# Altium schematic sheet 04. DDRAM.SchDoc
size A3
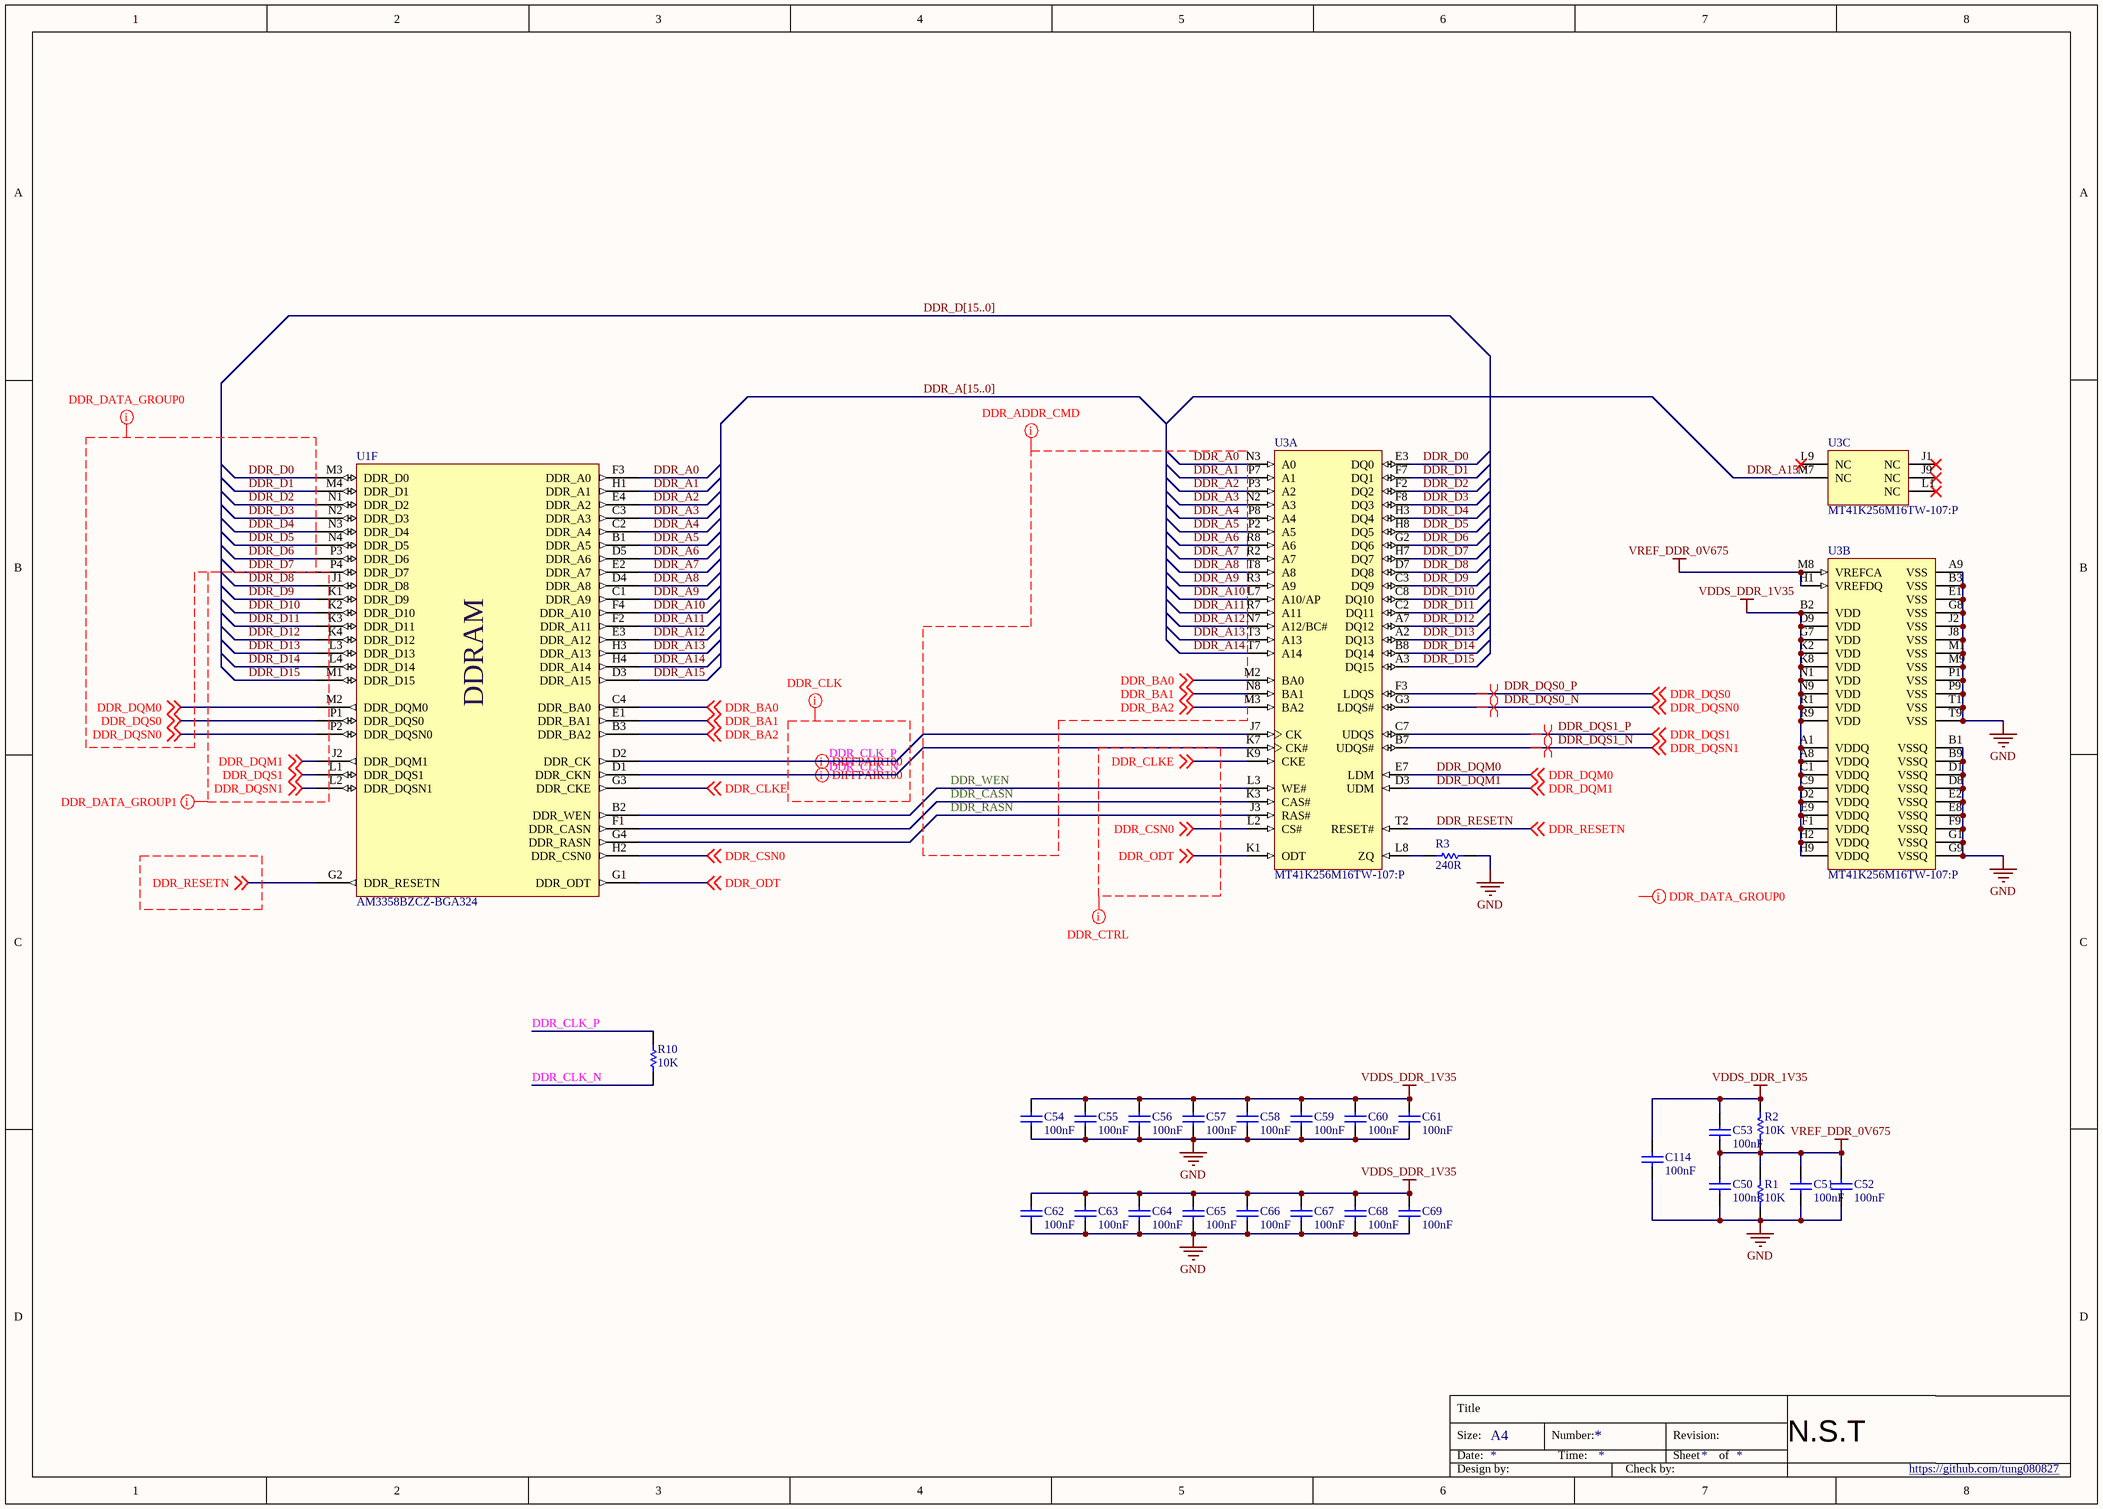
[diagram p0: 04. DDRAM.SchDoc]

## Parts
C50  100nF  [CAPC1005X60X30LL05T10]
C51  100nF  [CAPC1005X60X30LL05T10]
C52  100nF  [CAPC1005X60X30LL05T10]
C53  100nF  [CAPC1005X60X30LL05T10]
C54  100nF  [CAPC1005X60X30LL05T10]
C55  100nF  [CAPC1005X60X30LL05T10]
C56  100nF  [CAPC1005X60X30LL05T10]
C57  100nF  [CAPC1005X60X30LL05T10]
C58  100nF  [CAPC1005X60X30LL05T10]
C59  100nF  [CAPC1005X60X30LL05T10]
C60  100nF  [CAPC1005X60X30LL05T10]
C61  100nF  [CAPC1005X60X30LL05T10]
C62  100nF  [CAPC1005X60X30LL05T10]
C63  100nF  [CAPC1005X60X30LL05T10]
C64  100nF  [CAPC1005X60X30LL05T10]
C65  100nF  [CAPC1005X60X30LL05T10]
C66  100nF  [CAPC1005X60X30LL05T10]
C67  100nF  [CAPC1005X60X30LL05T10]
C68  100nF  [CAPC1005X60X30LL05T10]
C69  100nF  [CAPC1005X60X30LL05T10]
C114  100nF  [CAPC1005X60X30LL05T10]
R1  10K  [RESC1005X40X25LL05T05]
R2  10K  [RESC1005X40X25LL05T05]
R3  240R  [RESC1005X40X25LL05T05]
R10  10K  [RESC1005X40X25ML05T05]
U1  AM3358BZCZ-BGA324  [TI-ZCZ324]  (part F of 11)
U3  MT41K256M16TW-107:P  [MICT-TW-96]  (parts A,B,C of 3)

## Nets
GND: C50.1 C51.1 C52.1 C54.1 C55.1 C56.1 C57.1 C58.1 C59.1 C60.1 C61.1 C62.1 C63.1 C64.1 C65.1 C66.1 C67.1 C68.1 C69.1 C114.1 R1.1 R3.2 U3.A9(VSS) U3.B1(VSSQ) U3.B3(VSS) U3.B9(VSSQ) U3.D1(VSSQ) U3.D8(VSSQ) U3.E1(VSS) U3.E2(VSSQ) U3.E8(VSSQ) U3.F9(VSSQ) U3.G1(VSSQ) U3.G8(VSS) U3.G9(VSSQ) U3.J2(VSS) U3.J8(VSS) U3.M1(VSS) U3.M9(VSS) U3.P1(VSS) U3.P9(VSS) U3.T1(VSS) U3.T9(VSS)
VDDS_DDR_1V35: C53.2 C54.2 C55.2 C56.2 C57.2 C58.2 C59.2 C60.2 C61.2 C62.2 C63.2 C64.2 C65.2 C66.2 C67.2 C68.2 C69.2 C114.2 R2.2 U3.A1(VDDQ) U3.A8(VDDQ) U3.B2(VDD) U3.C1(VDDQ) U3.C9(VDDQ) U3.D2(VDDQ) U3.D9(VDD) U3.E9(VDDQ) U3.F1(VDDQ) U3.G7(VDD) U3.H2(VDDQ) U3.H9(VDDQ) U3.K2(VDD) U3.K8(VDD) U3.N1(VDD) U3.N9(VDD) U3.R1(VDD) U3.R9(VDD)
VREF_DDR_0V675: C50.2 C51.2 C52.2 C53.1 R1.2 R2.1 U3.H1(VREFDQ) U3.M8(VREFCA)
DDR_A0: U1.F3(DDR_A0) U3.N3(A0)
DDR_A1: U1.H1(DDR_A1) U3.P7(A1)
DDR_A2: U1.E4(DDR_A2) U3.P3(A2)
DDR_A3: U1.C3(DDR_A3) U3.N2(A3)
DDR_A4: U1.C2(DDR_A4) U3.P8(A4)
DDR_A5: U1.B1(DDR_A5) U3.P2(A5)
DDR_A6: U1.D5(DDR_A6) U3.R8(A6)
DDR_A7: U1.E2(DDR_A7) U3.R2(A7)
DDR_A8: U1.D4(DDR_A8) U3.T8(A8)
DDR_A9: U1.C1(DDR_A9) U3.R3(A9)
DDR_A10: U1.F4(DDR_A10) U3.L7(A10/AP)
DDR_A11: U1.F2(DDR_A11) U3.R7(A11)
DDR_A12: U1.E3(DDR_A12) U3.N7(A12/BC#)
DDR_A13: U1.H3(DDR_A13) U3.T3(A13)
DDR_A14: U1.H4(DDR_A14) U3.T7(A14)
DDR_A15: U1.D3(DDR_A15) U3.M7(NC)
DDR_BA0: U1.C4(DDR_BA0) U3.M2(BA0) ; off-sheet DDR_BA0
DDR_BA1: U1.E1(DDR_BA1) U3.N8(BA1) ; off-sheet DDR_BA1
DDR_BA2: U1.B3(DDR_BA2) U3.M3(BA2) ; off-sheet DDR_BA2
DDR_CASN: U1.F1(DDR_CASN) U3.K3(CAS#)
DDR_CLK_N: R10.2 U1.D1(DDR_CKN) U3.K7(CK#)
DDR_CLK_P: R10.1 U1.D2(DDR_CK) U3.J7(CK)
DDR_CLKE: U1.G3(DDR_CKE) U3.K9(CKE) ; off-sheet DDR_CLKE
DDR_CSN0: U1.H2(DDR_CSN0) U3.L2(CS#) ; off-sheet DDR_CSN0
DDR_D0: U1.M3(DDR_D0) U3.E3(DQ0)
DDR_D1: U1.M4(DDR_D1) U3.F7(DQ1)
DDR_D2: U1.N1(DDR_D2) U3.F2(DQ2)
DDR_D3: U1.N2(DDR_D3) U3.F8(DQ3)
DDR_D4: U1.N3(DDR_D4) U3.H3(DQ4)
DDR_D5: U1.N4(DDR_D5) U3.H8(DQ5)
DDR_D6: U1.P3(DDR_D6) U3.G2(DQ6)
DDR_D7: U1.P4(DDR_D7) U3.H7(DQ7)
DDR_D8: U1.J1(DDR_D8) U3.D7(DQ8)
DDR_D9: U1.K1(DDR_D9) U3.C3(DQ9)
DDR_D10: U1.K2(DDR_D10) U3.C8(DQ10)
DDR_D11: U1.K3(DDR_D11) U3.C2(DQ11)
DDR_D12: U1.K4(DDR_D12) U3.A7(DQ12)
DDR_D13: U1.L3(DDR_D13) U3.A2(DQ13)
DDR_D14: U1.L4(DDR_D14) U3.B8(DQ14)
DDR_D15: U1.M1(DDR_D15) U3.A3(DQ15)
DDR_DQM0: U1.M2(DDR_DQM0) U3.E7(LDM) ; off-sheet DDR_DQM0
DDR_DQM1: U1.J2(DDR_DQM1) U3.D3(UDM) ; off-sheet DDR_DQM1
DDR_DQS0_N: U1.P2(DDR_DQSN0) U3.G3(LDQS#) ; off-sheet DDR_DQSN0  [also labelled DDR_DQSN0]
DDR_DQS0_P: U1.P1(DDR_DQS0) U3.F3(LDQS) ; off-sheet DDR_DQS0  [also labelled DDR_DQS0]
DDR_DQS1_N: U1.L2(DDR_DQSN1) U3.B7(UDQS#) ; off-sheet DDR_DQSN1  [also labelled DDR_DQSN1]
DDR_DQS1_P: U1.L1(DDR_DQS1) U3.C7(UDQS) ; off-sheet DDR_DQS1  [also labelled DDR_DQS1]
DDR_ODT: U1.G1(DDR_ODT) U3.K1(ODT) ; off-sheet DDR_ODT
DDR_RASN: U1.G4(DDR_RASN) U3.J3(RAS#)
DDR_RESETN: U1.G2(DDR_RESETN) U3.T2(RESET#) ; off-sheet DDR_RESETN
DDR_WEN: U1.B2(DDR_WEN) U3.L3(WE#)
NetR3_1: R3.1 U3.L8(ZQ)

Not connected (* = marked no-connect by the designer): U3 J1(NC)* J9(NC)* L1(NC)* L9(NC)*

## Buses and harness runs
bus DDR_A[15..0]
bus DDR_D[15..0]

## Layout directives
net class DDR_DATA_GROUP0; rule Matched Net Lengths [Tolerance = 10mil]: DDR_D0, DDR_D1, DDR_D2, DDR_D3, DDR_D4, DDR_D5, DDR_D6, DDR_D7, DDR_DQM0, DDR_DQS0, DDR_DQSN0
net class DDR_DATA_GROUP1; rule Matched Net Lengths [Tolerance = 10mil]: DDR_D7, DDR_D8, DDR_D9, DDR_D10, DDR_D11, DDR_D12, DDR_D13, DDR_D14, DDR_D15, DDR_DQM1, DDR_DQS1, DDR_DQSN1
net class DDR_DATA_GROUP0; rule Matched Net Lengths [Tolerance = 20mil]: (no net found under the mark)
net class DDR_ADDR_CMD; rule Matched Net Lengths [Tolerance = 20mil]; Parameter 1: MATCHED LENGTH: DDR_A0, DDR_A1, DDR_A2, DDR_A3, DDR_A4, DDR_A5, DDR_A6, DDR_A7, DDR_A8, DDR_A9, DDR_A10, DDR_A11, DDR_A12, DDR_A13, DDR_A14, DDR_BA0, DDR_BA1, DDR_BA2, DDR_CASN, DDR_RASN, DDR_WEN
net class DDR_CLK: DDR_CLK_N, DDR_CLK_P
net class DDR_CTRL; rule Matched Net Lengths [Tolerance = 20mil]: DDR_CLKE, DDR_CSN0, DDR_ODT
differential pair; differential pair class DDR_CLK_DIFF; rule Matched Net Lengths [Tolerance = 1mil]: DDR_CLK_N, DDR_CLK_P
differential pair; differential pair class DDRDQS_GROUP0; rule Matched Net Lengths [Tolerance = 1mil]: DDR_DQS0_N, DDR_DQS0_P
differential pair; differential pair class DDRDQS_GROUP1; rule Matched Net Lengths [Tolerance = 1mil]: DDR_DQS1_N, DDR_DQS1_P

## Notes on the sheet
- Title
- Size:
- Date:
- A4
- Number:
- Time:
- Revision:
- Sheet
- of
- N.S.T
- Design by:
- Check by:
- https://github.com/tung080827
- (in symbol AM3358BZCZ100, part F) DDRAM

## Library data of the parts
C50-C69 C114 = CMP-2100-03641-1: Chip Capacitor, 0.1 uF, +/- 10%, 16 V, -55 to 125 degC, 0402 (1005 Metric), RoHS, Tape and Reel; Manufacturer: Murata; Material: Ceramic; Insulation Resistance: 10GR; Voltage: 16V; Dielectric: X7R; REACH SVHC: NoSVHC; Depth: 0.5mm; Case/Package: 0402; Datasheet URL: http://psearch.en.murata.com/capacitor/product/GRM155R71C104KA88%23.pdf; Lead Free: LeadFree; Dielectric Material: Ceramic; Manufacturer URL: http://www.murata.com/; Min Operating Temperature: -55degC; Length: 1mm; Case Code (Metric): 1005; Radiation Hardening: No; Package Reference: 0402; RoHSCompliant: true; Datasheet Version: 42675.0; Thickness: 0.022inch; Packaging: TapeandReel; Voltage Rating (DC): 16V; Tolerance: 10%; Max Operating Temperature: 125degC; Package Description: 2-Pin Surface Mount Device, Body 1 x 0.5 mm; Mount: SurfaceMount; Height: 0.5mm; Width: 0.5mm; Number of Pins: 2; Voltage Rating: 16V; Case Code (Imperial): 0402; Termination: SMD/SMT; Capacitance: 100nF; Package Quantity: 1
R1 R2 R10 = CMP-2002-08397-1: SMD Resistor 1K Ohm 1/16W, 1%, 0402; Manufacturer: Vishay Dale; Part Number: CRCW0402240RFKED
R3 = CMP-2002-08397-1: SMD Resistor 240 Ohm 1/16W, 1%, 0402; Manufacturer: Vishay Dale; Part Number: CRCW0402240RFKED
U1 = AM3358BZCZ100: Sitara ARM Cortex-A8 32-Bit RISC Microprocessor, 1 GHz, SGX530 3D Graphics Engine, Programmable Real-Time Unit and Industrial Communication Subsystem (PRU-ICSS), 0 to 90 degC, 324-pin NFBGA (ZCZ), Green (RoHS & no Sb/Br); Supplier 1: Digi-Key
U3 = CMP-2000-07475-1: DDR3L SDRAM, 4 GB, 933 MHz, 1.283 to 1.45 V, 0 to 95 degC, 96-Pin FBGA, RoHS, Tray; Manufacturer: Micron; Density: 4Gb; Memory Type: RAM; Access Time: 20ns; Frequency: 933MHz; Address Bus Width: 15b; Interface: Parallel; Data Bus Width: 16b; Mount: SurfaceMount; RoHSCompliant: true; Min Operating Temperature: 0degC; Package Description: 96-Ball Fine Pitch Ball Grid Array, Body 14 x 8 mm, Pitch 0.8 mm; Datasheet URL: https://www.micron.com/~/media/documents/products/data-sheet/dram/ddr3/4gb_ddr3l.pdf; Max Frequency: 933MHz; Contact Plating: Silver; Max Operating Temperature: 95degC; Case\/Package: FBGA; Datasheet Version: Rev. P, 05/2017; Manufacturer URL: http://www.micron.com/; Package Reference: TW-96; Mounting Technology: SurfaceMount